# EAGLE design eagle-APDS-9960 (EAGLE 7.3.0)
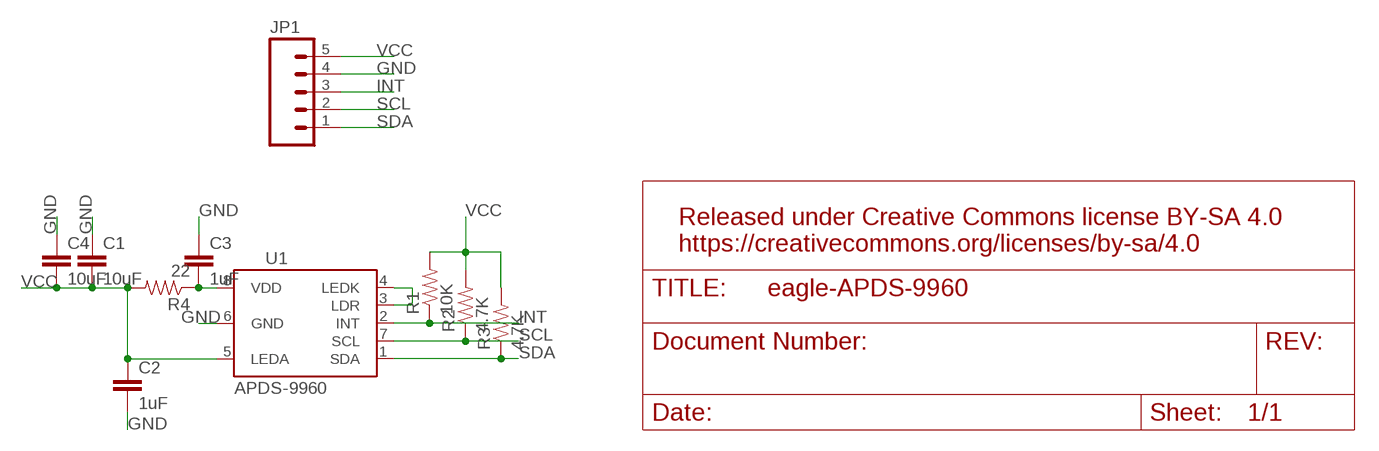
[diagram p0: schematic, sheet 1]

## Parts
C1  10uF  CAP0805  [0805]
C2  1uF  CAP0805  [0805]
C3  1uF  CAP0805  [0805]
C4  10uF  CAP0805  [0805]
JP1  M05PTH  [1X05]
R1  10K  RESISTOR0603-RES  [0603-RES]
R2  4.7K  RESISTOR0603-RES  [0603-RES]
R3  4.7K  RESISTOR0603-RES  [0603-RES]
R4  22  RESISTOR0603-RES  [0603-RES]
U1  APDS-9960  [APDS-9960]

## Nets
GND: C1.1 C2.2 C3.1 C4.1 JP1.4 U1.6(GND)
INT: JP1.3 R1.1 U1.2(INT)
N$1: U1.3(LDR) U1.4(LEDK)
N$5: C3.2 R4.1 U1.8(VDD)
SCL: JP1.2 R2.1 U1.7(SCL)
SDA: JP1.1 R3.1 U1.1(SDA)
VCC: C1.2 C2.1 C4.2 JP1.5 R1.2 R2.2 R3.2 R4.2 U1.5(LEDA)

## Notes on the sheet
- Released under Creative Commons license BY-SA 4.0
  https://creativecommons.org/licenses/by-sa/4.0

## Library data of the parts
C1-C4 = SparkFun-Passives:CAP: Capacitor Standard 0603 ceramic capacitor, and 0.1" leaded capacitor.
JP1 = SparkFun-Connectors:M05: Header 5 Standard 5-pin 0.1" header. Use with straight break away headers (SKU : PRT-00116), right angle break away headers (PRT-00553), swiss pins (PRT-00743), machine pins (PRT-00117), and female headers (PRT-00115). Molex polarized connector foot print use with SKU : PRT-08230 with associated crimp pins and housings.
R1-R4 = SparkFun-Passives:RESISTOR: Resistor Basic schematic elements and footprints for 0603, 1206, and PTH resistors.
U1 = SparkFun-Sensors:APDS-9960: Avago APDS-9960 digital proximity, ambient light, RGB, and gesture sensor.; PROD_ID: SEN-12005

## Board
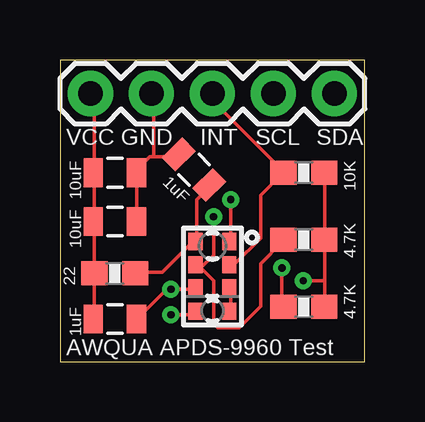
[diagram p1: board, top side]
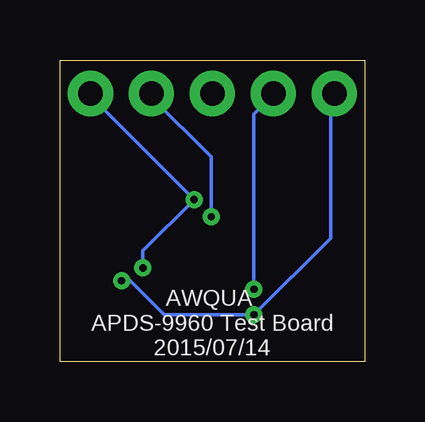
[diagram p2: board, bottom side, seen from below]

Size 12.7 x 12.57 mm. Coordinates in mm from the lower left corner, seen from the top.
Outline: 0,0 12.7,0 12.7,12.57 0,12.56 0,0
Copper layers (1*16): Top 0.035mm / dielectric 1.5mm / Bottom 0.035mm
Design rules "default *": minimum track width 6mil, minimum drill 12mil, track to track 8mil, track to pad 8mil, pad to pad 8mil, via to via 8mil, smd to smd 8mil, copper to edge 40mil, drill to drill 8mil, minimum pad ring 10mil, minimum via ring 8mil, stop-mask expansion 4mil, vias tented up to drill 13mil, thermal gap 10mil

### Footprints (pad centres in the part's own frame; a part is rotated, then mirrored left to right if it is on the bottom)
0805 = smd 0.8 x 1.2: 1 -0.9,0; 2 0.9,0
1X05 = drill 1.016 pad 1.88: 1 0,0; 2 2.54,0; 3 5.08,0; 4 7.62,0; 5 10.16,0
0603-RES = smd 1.1 x 1: 1 -0.85,0; 2 0.85,0
APDS-9960 = smd 0.6 x 0.72: 1 0.7,1.455; 2 0.7,0.485; 3 0.7,-0.485; 4 0.7,-1.455; 5 -0.7,-1.455; 6 -0.7,-0.485; 7 -0.7,0.485; 8 -0.7,1.455

### Placement (x,y rotation side)
C1  2.29,7.87 180 top
C2  2.29,1.78 0 top
C3  5.59,8 315 top
C4  2.29,5.84 180 top
JP1  11.43,11.18 180 top
R1  10.16,7.87 0 top
R2  10.16,5.08 0 top
R3  10.16,2.29 0 top
R4  2.29,3.68 180 top
U1  6.35,3.56 0 top

### Tracks (layer width: path | path; a pad name or v marks a point on that pad's centre or on a via)
GND  (via drill 0.3)
  Top 0.152: C4.1 3.2,5.87 3.2,7.82 C1.1 3.2,8 3.73,8.53 3.91,8.53 | 3.91,8.53 4.8,8.53 C3.1 | U1.6 5.51,3.02 v4.62,3.02 4.45,3.02 C2.2 | 3.91,8.53 3.91,11.02 JP1.4
  Bottom 0.152: v4.62,3.02 4.62,10.31 3.91,11.02 JP1.4
INT
  Top 0.152: U1.2 7.11,4.09 7.29,4.09 8.36,5.16 8.36,6.93 9.25,7.82 R1.1 9.25,8 6.22,11.02 JP1.3
N$1
  Top 0.152: U1.4 7.11,2.13 7.11,3.02 U1.3
N$5
  Top 0.152: C3.2 6.22,7.29 5.69,6.76 5.69,5.16 U1.8 5.51,4.98 4.27,3.73 3.2,3.73 R4.1
SCL  (via drill 0.3)
  Top 0.152: 5.87,3.91 5.69,3.91 U1.7 5.87,3.91 | 5.87,3.91 6.4,3.38 6.4,1.6 6.58,1.42 7.47,1.42 8.36,2.31 8.36,4.09 9.25,4.98 R2.1 | 5.87,3.91 6.4,4.45 v6.4,6.04
  Bottom 0.152: v6.4,6.04 6.4,8.53 8.89,11.02 JP1.2
SDA  (via drill 0.3)
  Top 0.152: v7.11,6.76 7.11,5.16 U1.1 | v9.25,3.91 9.25,2.31 R3.1
  Bottom 0.152: JP1.1 11.38,11.02 v7.11,6.76 9.25,4.62 v9.25,3.91
VCC  (via drill 0.3)
  Top 0.152: C2.1 1.42,1.78 1.42,3.56 R4.2 1.42,3.73 1.42,5.69 C4.2 1.42,5.87 1.42,7.82 C1.2 1.42,8 1.42,11.02 JP1.5 | 11.02,3.38 11.02,4.98 R2.2 11.02,5.16 11.02,7.82 R1.2 | 11.02,3.38 11.02,2.31 R3.2 | v4.62,1.96 5.51,1.96 U1.5 | v10.13,3.38 11.02,3.38
  Bottom 0.152: JP1.5 1.42,11.02 1.42,5.16 v4.62,1.96 8.36,1.96 9.78,3.38 v10.13,3.38

### Text on the board
tNames: VCC | GND | INT | SCL | SDA | AWQUA APDS-9960 Test
bNames: AWQUA / APDS-9960 Test Board / 2015/07/14
Document: Released under Creative Commons license BY-SA 4.0 / https://creativecommons.org/licenses/by-sa/4.0